# Altium schematic sheet Stabilizer_Pounder.SchDoc: Pounder
size 420 x 297 mm; Author: G.Kasprowicz; CompanyName: WUT ISE; DrawnBy: G.Kasprowicz; Organization: WUT ISE; Address1: PW ISE; Address2: Nowowiejska 15/19 00-665 Warsaw; Address3: gkasprow@gmail.com; DocumentNumber: 1; Revision: 2; SheetNumber: 1; SheetTotal: 7; ModifiedBy: -; CheckedDate: -; Title2: top; DivGrp: WUT ISE; Designer: G.Kasprowicz; ModifiedDate: -; ProjectName: Sensor Box
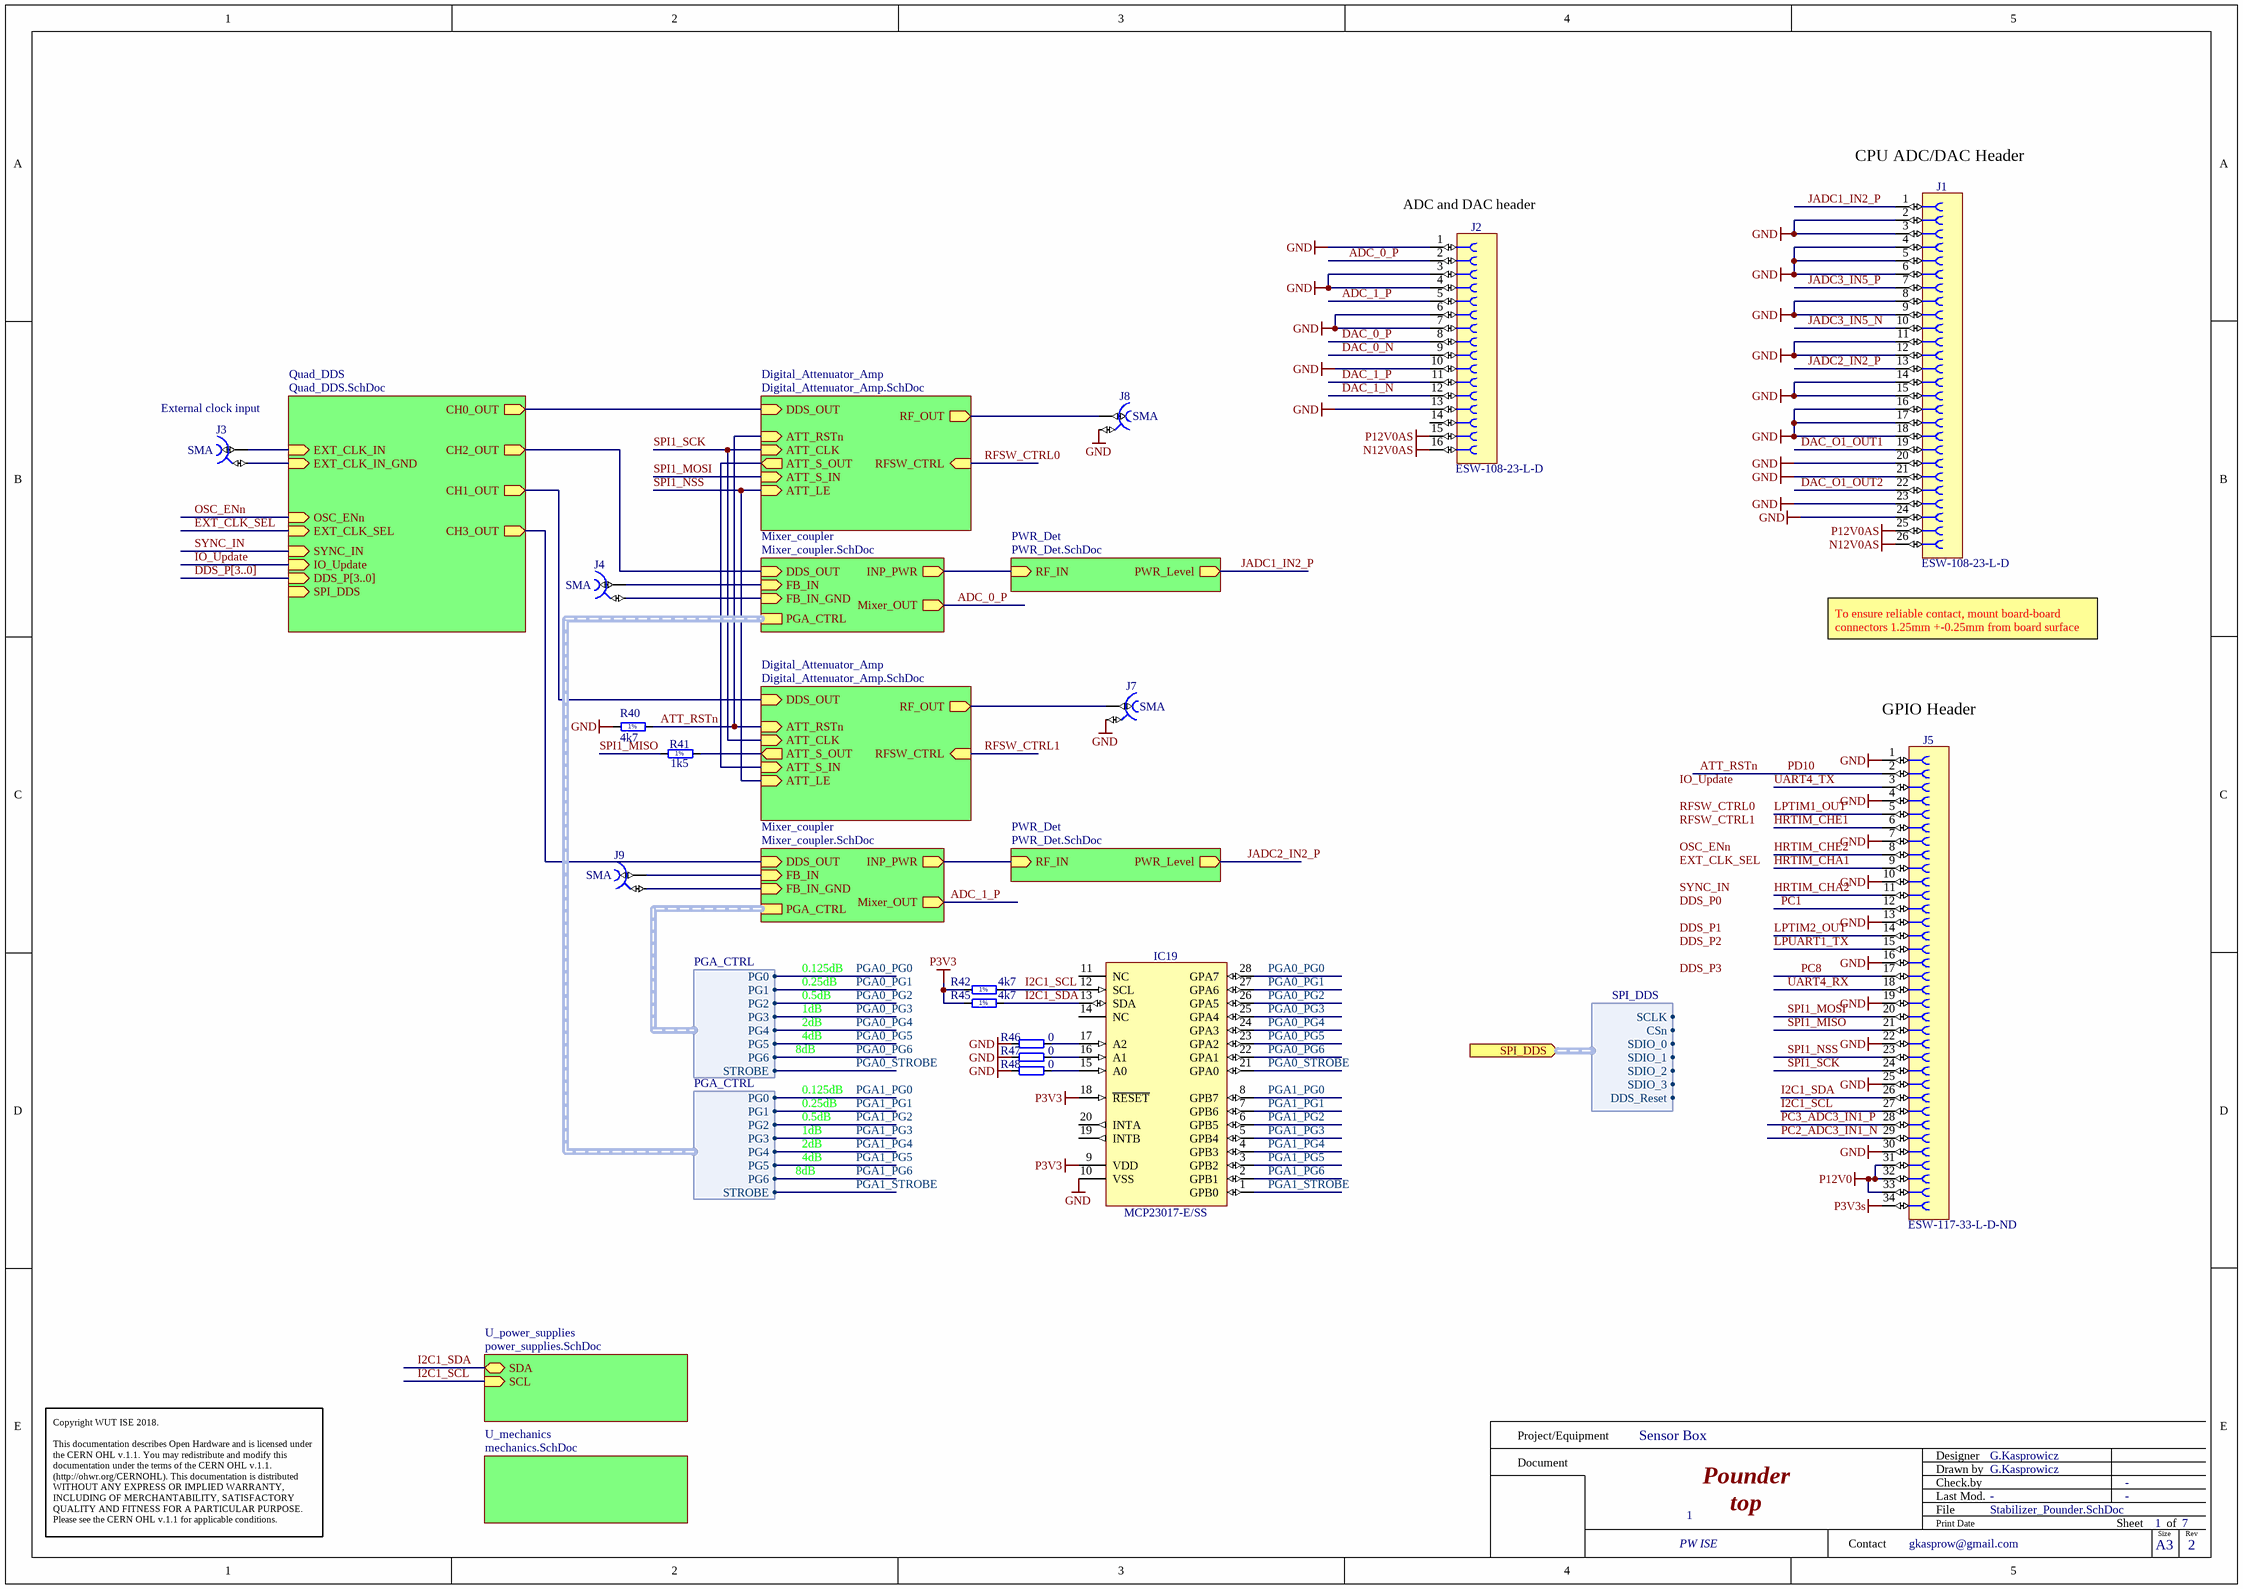
[diagram p0: Stabilizer_Pounder.SchDoc]

## Parts
IC19  MCP23017-E/SS  [SOP65P780X200-28N]
J1  ESW-108-23-L-D  [ESW-113-23-L-D]
J2  ESW-108-23-L-D  [ESW-108-23-L-D]
J3  SMA  [RF249BT0050GHDW]
J4  SMA  [RF249BT0050GHDW]
J5  Manufacturer Part Number: ESW-117-33-L-D-ND  [ESW-117-23-L-D]  (hidden comment: ESW-108-23-L-D)
J7  SMA  [RF249BT0050GHDW]
J8  SMA  [RF249BT0050GHDW]
J9  SMA  [RF249BT0050GHDW]
R40  4k7  [RESC1005X40N]
R41  1k5  [RESC1005X40N]
R42  4k7  [RESC1005X40N]
R45  4k7  [RESC1005X40N]
R46  0  [RESC1005X40N]
R47  0  [RESC1005X40N]
R48  0  [RESC1005X40N]

## Sub-sheets
Digital_Attenuator_Amp = Digital_Attenuator_Amp.SchDoc: RF_OUT (out), ATT_RSTn (in), ATT_CLK (in), ATT_S_OUT (out), RFSW_CTRL (in), ATT_S_IN (in), ATT_LE (in), DDS_OUT (in)
Digital_Attenuator_Amp = Digital_Attenuator_Amp.SchDoc: RF_OUT (out), ATT_RSTn (in), ATT_CLK (in), ATT_S_OUT (out), RFSW_CTRL (in), ATT_S_IN (in), ATT_LE (in), DDS_OUT (in)
Mixer_coupler = Mixer_coupler.SchDoc: INP_PWR (out), FB_IN (in), FB_IN_GND (in), PGA_CTRL (harness PGA_CTRL), DDS_OUT (in), Mixer_OUT (out)
Mixer_coupler = Mixer_coupler.SchDoc: INP_PWR (out), FB_IN (in), FB_IN_GND (in), PGA_CTRL (harness PGA_CTRL), DDS_OUT (in), Mixer_OUT (out)
PWR_Det = PWR_Det.SchDoc: RF_IN (in), PWR_Level (out)
PWR_Det = PWR_Det.SchDoc: RF_IN (in), PWR_Level (out)
Quad_DDS = Quad_DDS.SchDoc: CH3_OUT (out), CH1_OUT (out), OSC_ENn (in), CH0_OUT (out), EXT_CLK_SEL (in), EXT_CLK_IN (in), CH2_OUT (out), EXT_CLK_IN_GND (in), SYNC_IN (in), IO_Update (in), DDS_P[3..0] (in), SPI_DDS (in, harness SPI_DDS)
U_mechanics = mechanics.SchDoc: no entries
U_power_supplies = power_supplies.SchDoc: SDA (bidir), SCL (in)

## Ports
SPI_DDS (in, harness SPI_DDS)

## Harnesses
PGA_CTRL: PG0, PG1, PG2, PG3, PG4, PG5, PG6, STROBE
SPI_DDS: SCLK, CSn, SDIO_0, SDIO_1, SDIO_2, SDIO_3, DDS_Reset

## Nets
GND: IC19.10(VSS) J1.2 J1.3 J1.4 J1.5 J1.6 J1.8 J1.9 J1.11 J1.12 J1.14 J1.15 J1.16 J1.17 J1.18 J1.20 J1.21 J1.23 J1.24 J2.1 J2.3 J2.4 J2.6 J2.7 J2.10 J2.13 J5.1 J5.4 J5.7 J5.10 J5.13 J5.16 J5.19 J5.22 J5.25 J5.30 J7.2 J8.2 R40.1 R46.1 R47.1 R48.1
N12V0AS: J1.26 J2.16
P3V3: IC19.9(VDD) IC19.18(~{RESET}) R42.1 R45.1
P3V3s: J5.34
P12V0: J5.31 J5.32 J5.33
P12V0AS: J1.25 J2.15
ADC_0_P: J2.2 ; sheet Mixer_coupler/Mixer_OUT
ADC_1_P: J2.5 ; sheet Mixer_coupler/Mixer_OUT
ATT_RSTn: J5.2 R40.2 ; sheet Digital_Attenuator_Amp/ATT_RSTn, sheet Digital_Attenuator_Amp/ATT_RSTn  [also labelled PD10]
DAC_0_N: J2.9
DAC_0_P: J2.8
DAC_1_N: J2.12
DAC_1_P: J2.11
DAC_O1_OUT1: J1.19
DAC_O1_OUT2: J1.22
EXT_CLK_SEL: sheet Quad_DDS/EXT_CLK_SEL
HRTIM_CHA1: J5.9
HRTIM_CHA2: J5.11
HRTIM_CHE1: J5.6
HRTIM_CHE2: J5.8
I2C1_SCL: IC19.12(SCL) J5.27 R42.2 ; sheet U_power_supplies/SCL
I2C1_SDA: IC19.13(SDA) J5.26 R45.2 ; sheet U_power_supplies/SDA
IO_Update: sheet Quad_DDS/IO_Update
JADC1_IN2_P: J1.1 ; sheet PWR_Det/PWR_Level
JADC2_IN2_P: J1.13 ; sheet PWR_Det/PWR_Level
JADC3_IN5_N: J1.10
JADC3_IN5_P: J1.7
LPTIM1_OUT: J5.5
LPTIM2_OUT: J5.14
LPUART1_TX: J5.15
OSC_ENn: sheet Quad_DDS/OSC_ENn
PC1: J5.12
PC2_ADC3_IN1_N: J5.29
PC3_ADC3_IN1_P: J5.28
PC8: J5.17
PGA0_PG0: IC19.28(GPA7) ; sheet Mixer_coupler/PGA_CTRL.PG0
PGA0_PG1: IC19.27(GPA6) ; sheet Mixer_coupler/PGA_CTRL.PG1
PGA0_PG2: IC19.26(GPA5) ; sheet Mixer_coupler/PGA_CTRL.PG2
PGA0_PG3: IC19.25(GPA4) ; sheet Mixer_coupler/PGA_CTRL.PG3
PGA0_PG4: IC19.24(GPA3) ; sheet Mixer_coupler/PGA_CTRL.PG4
PGA0_PG5: IC19.23(GPA2) ; sheet Mixer_coupler/PGA_CTRL.PG5
PGA0_PG6: IC19.22(GPA1) ; sheet Mixer_coupler/PGA_CTRL.PG6
PGA0_STROBE: IC19.21(GPA0) ; sheet Mixer_coupler/PGA_CTRL.STROBE
PGA1_PG0: IC19.8(GPB7) ; sheet Mixer_coupler/PGA_CTRL.PG0
PGA1_PG1: IC19.7(GPB6) ; sheet Mixer_coupler/PGA_CTRL.PG1
PGA1_PG2: IC19.6(GPB5) ; sheet Mixer_coupler/PGA_CTRL.PG2
PGA1_PG3: IC19.5(GPB4) ; sheet Mixer_coupler/PGA_CTRL.PG3
PGA1_PG4: IC19.4(GPB3) ; sheet Mixer_coupler/PGA_CTRL.PG4
PGA1_PG5: IC19.3(GPB2) ; sheet Mixer_coupler/PGA_CTRL.PG5
PGA1_PG6: IC19.2(GPB1) ; sheet Mixer_coupler/PGA_CTRL.PG6
PGA1_STROBE: IC19.1(GPB0) ; sheet Mixer_coupler/PGA_CTRL.STROBE
RFSW_CTRL0: sheet Digital_Attenuator_Amp/RFSW_CTRL
RFSW_CTRL1: sheet Digital_Attenuator_Amp/RFSW_CTRL
SPI1_MISO: J5.21 R41.1
SPI1_MOSI: J5.20 ; sheet Digital_Attenuator_Amp/ATT_S_IN
SPI1_NSS: J5.23 ; sheet Digital_Attenuator_Amp/ATT_LE, sheet Digital_Attenuator_Amp/ATT_LE
SPI1_SCK: J5.24 ; sheet Digital_Attenuator_Amp/ATT_CLK, sheet Digital_Attenuator_Amp/ATT_CLK
SYNC_IN: sheet Quad_DDS/SYNC_IN
UART4_RX: J5.18
UART4_TX: J5.3
NetIC19_15: IC19.15(A0) R48.2
NetIC19_16: IC19.16(A1) R47.2
NetIC19_17: IC19.17(A2) R46.2
NetJ3_1: J3.1 ; sheet Quad_DDS/EXT_CLK_IN
NetJ3_2: J3.2 ; sheet Quad_DDS/EXT_CLK_IN_GND
NetJ4_1: J4.1 ; sheet Mixer_coupler/FB_IN
NetJ4_2: J4.2 ; sheet Mixer_coupler/FB_IN_GND
NetJ7_1: J7.1 ; sheet Digital_Attenuator_Amp/RF_OUT
NetJ8_1: J8.1 ; sheet Digital_Attenuator_Amp/RF_OUT
NetJ9_1: J9.1 ; sheet Mixer_coupler/FB_IN
NetJ9_2: J9.2 ; sheet Mixer_coupler/FB_IN_GND
NetR41_2: R41.2 ; sheet Digital_Attenuator_Amp/ATT_S_OUT
(unnamed): sheet Quad_DDS/CH3_OUT, sheet Mixer_coupler/DDS_OUT
(unnamed): sheet Quad_DDS/CH1_OUT, sheet Digital_Attenuator_Amp/DDS_OUT
(unnamed): sheet Quad_DDS/CH0_OUT, sheet Digital_Attenuator_Amp/DDS_OUT
(unnamed): sheet Quad_DDS/CH2_OUT, sheet Mixer_coupler/DDS_OUT
(unnamed): sheet Digital_Attenuator_Amp/ATT_S_OUT, sheet Digital_Attenuator_Amp/ATT_S_IN
(unnamed): sheet PWR_Det/RF_IN, sheet Mixer_coupler/INP_PWR
(unnamed): sheet PWR_Det/RF_IN, sheet Mixer_coupler/INP_PWR

Not connected (* = marked no-connect by the designer): IC19 11(NC) 14(NC) 19(INTB) 20(INTA); J2 14

## Buses and harness runs
bus DDS_P[3..0] = sheet Quad_DDS/DDS_P[3..0]

## Notes on the sheet
- (near J1) CPU ADC/DAC Header
- (near J2) ADC and DAC header
- (near J3) External clock input
- To ensure reliable contact, mount board-board connectors 1.25mm +-0.25mm from board surface
- (near J5) GPIO Header
- 0.125dB
- 0.5dB
- 0.25dB
- 8dB
- 4dB
- 1dB
- 2dB
- Labels drawn without touching a wire or pin: DDS_P0, DDS_P1, DDS_P2, DDS_P3, EXT_CLK_SEL, IO_Update, OSC_ENn, RFSW_CTRL0, RFSW_CTRL1, SYNC_IN
- Project/Equipment
- Document
- Designer
- Drawn by
- Check.by
- Copyright WUT ISE 2018.
  This documentation describes Open Hardware and is licensed under the CERN OHL v.1.1. You may redistribute and modify this documentation under the terms of the CERN OHL v.1.1. (http://ohwr.org/CERNOHL). This documentation is distributed WITHOUT ANY EXPRESS OR IMPLIED WARRANTY, INCLUDING OF MERCHANTABILITY, SATISFACTORY QUALITY AND FITNESS FOR A PARTICULAR PURPOSE. Please see the CERN OHL v.1.1 for applicable conditions.
- Contact
- File
- Last Mod.
- Print Date
- Sheet
- Size
- A3
- of
- Rev
- (in symbol R0402_1K5_1%_0.0625W_100PPM) 1%
- (in symbol R0402_4K7_1%_0.0625W_100PPM) 1%

## Library data of the parts
IC19 = MCP23017-E/SS: 16-bit I/O Port Expander With Serial Interface; Manufacturer: MICROCHIP TECHNOLOGY; PressFit: No; Bonding: No; Part Number: MCP23017-E/SS; Component Kind: Standard; Component Type: Standard; Device: MCP23017-E/SS; PackageDescription: SOP, 0.65mm Pitch; 28 pin, 5.30mm W X 10.20mm L X 2.00mm H body, IPC Medium Density; Part Description: 16-bit I/O Port Expander With Serial Interface; Manufacturer Part Number: MCP23017-E/SS; Pin Count: 28; Case: SSOP28; Mounted: Yes; Socket: No; SMD: Yes; Sense: No; ComponentHeight: 2mm; Author: CERN DEM JLC; HelpURL: \\cern.ch\dfs\Applications\Altium\Datasheets\MCP23017-E-SS.pdf; CreateDate: 17.01.2011; LatestRevisionDate: 17.01.2011
J1 = ESW-113-23-L-D: Connector Elevated Socket 26 POS 2.54mm, 13.59mm height; Manufacturer: Samtec; Manufacturer Part Number: ESW-108-23-L-D
J2 = ESW-108-23-L-D: Connector Elevated Socket 16 POS 2.54mm, 13.59mm height; Manufacturer: Samtec; Manufacturer Part Number: ESW-108-23-L-D
J3 J4 J7-J9 = CON_SMA_RF249BT0050GHDW: 50 Ohm Through Hole SMA Right Angle PCB Jack; Part Number: AdamTech_RF249BT0050GHDW; Manufacturer: AdamTech; PressFit: No; Component Kind: Standard; Component Type: Standard; Pin Count: 5; Family: SMA; Mounted: Yes; Socket: No; SMD: No; Sense: No; Status: None; Part Description: 50 Ohm Through Hole SMA Right Angle PCB Jack; Manufacturer Part Number: RF249BT0050GHDW; ComponentHeight: 10.44mm; HelpURL: \\cern.ch\dfs\Applications\Altium\Datasheets\AMPHENOL_132203.pdf; Author: GK; CreateDate: 06.10.2016; LatestRevisionDate: 06.10.2016
J5 = ESW-117-23-L-D: Connector Elevated Socket 34 POS 2.54mm, 13.59mm height; Manufacturer: Samtec
R40 R42 R45 = R0402_4K7_1%_0.0625W_100PPM: Resistor - 1%; Part Description: General Purpose Thick Film Chip Resistor; Manufacturer: GENERIC; Manufacturer1 Part Number: 232270674702L; TC: ±100ppm/°C; Part Number: R0402_4K7_1%_0.0625W_100PPM; Component Kind: Standard; Component Type: Standard; Pin Count: 2; Value: 4k7; Status: Not recommended; Power: 0.0625W; Tolerance: ±1%; Manufacturer Part Number: R0402_4K7_1%_0.0625W_100PPM; Case: 0402; Mounted: Yes; Sense: No; Socket: No; SMD: Yes; Manufacturer1 Example: YAGEO PHYCOMP; Manufacturer1 ComponentHeight: 0.4mm; HelpURL: \\cern.ch\dfs\Applications\Altium\Datasheets\R0402_Phycomp_RC0402.pdf; Author: CERN DEM JLC; CreateDate: 2007-12-03; LatestRevisionDate: 2012-10-17
R41 = R0402_1K5_1%_0.0625W_100PPM: Resistor - 1%; Part Description: General Purpose Thick Film Chip Resistor; Manufacturer: GENERIC; Manufacturer1 Part Number: 232270671502L; TC: ±100ppm/°C; PressFit: No; Part Number: R0402_1K5_1%_0.0625W_100PPM; Component Kind: Standard; Component Type: Standard; Pin Count: 2; Value: 1k5; Status: Not Recommended; Power: 0.0625W; Tolerance: ±1%; Manufacturer Part Number: R0402_1K5_1%_0.0625W_100PPM; Case: 0402; Mounted: Yes; Sense: No; Socket: No; SMD: Yes; Manufacturer1 Example: YAGEO PHYCOMP; Manufacturer1 ComponentHeight: 0.4mm; HelpURL: \\cern.ch\dfs\Applications\Altium\Datasheets\R0402_Phycomp_RC0402.pdf; Author: CERN DEM JLC; CreateDate: 03.12.2007; LatestRevisionDate: 17.10.2012
R46-R48 = R0402_0R_JUMPER: Resistor; Part Description: 1A (0.05R Max DC Resistance) Zero Ohm Jumper; Manufacturer: GENERIC; Manufacturer1 Part Number: 232270591001L; Part Number: R0402_0R_JUMPER; Component Kind: Standard; Component Type: Standard; Pin Count: 2; Value: 0; Status: Not recommended; Manufacturer Part Number: R0402_0R_JUMPER; Case: 0402; Mounted: Yes; Sense: No; Socket: No; SMD: Yes; Manufacturer1 Example: YAGEO PHYCOMP; Manufacturer1 ComponentHeight: 0.4mm; HelpURL: \\cern.ch\dfs\Applications\Altium\Datasheets\R0402_Phycomp_RC0402.pdf; Author: CERN DEM JLC; CreateDate: 2007-12-03; LatestRevisionDate: 2012-10-17